# EAGLE design adapter_HVSP (EAGLE 5.04)
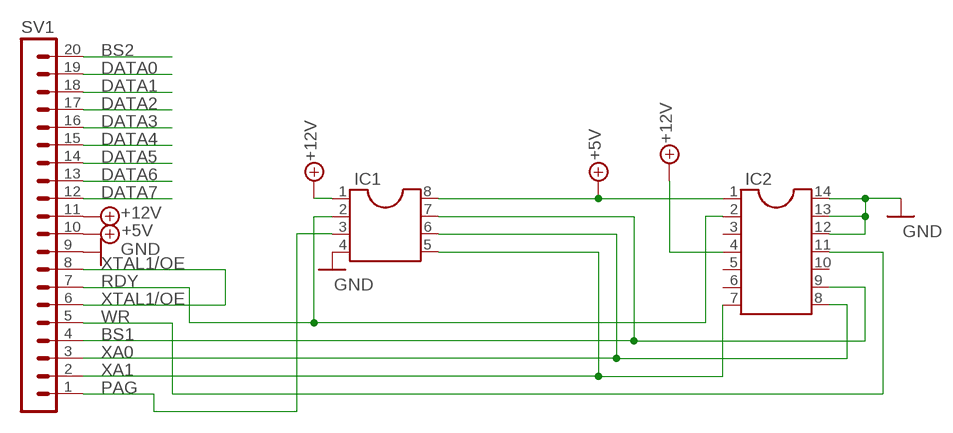
[diagram p0: schematic, sheet 1]

## Parts
IC1  DIL8S  [SOCKED-08]
IC2  DIL14S  [SOCKED-14]
SV1  MA20-1  [MA20-1]

## Nets
+5V: IC1.8 IC2.1 SV1.10
+12V: IC1.1 IC2.4 SV1.11
BS1: IC1.7 IC2.9 SV1.4
BS2: SV1.20
DATA0: SV1.19
DATA1: SV1.18
DATA2: SV1.17
DATA3: SV1.16
DATA4: SV1.15
DATA5: SV1.14
DATA6: SV1.13
DATA7: SV1.12
GND: IC1.4 IC2.12 IC2.13 IC2.14 SV1.9
PAG: IC1.3 SV1.1
RDY: IC1.2 IC2.2 SV1.7
WR: IC2.11 SV1.5
XA0: IC1.6 IC2.8 SV1.3
XA1: IC1.5 IC2.7 SV1.2
XTAL1/OE: SV1.6 SV1.8
Unconnected: IC2.3 IC2.5 IC2.6 IC2.10

## Library data of the parts
IC1 = ic-package:DIL8: Dual In Line
IC2 = ic-package:DIL14: Dual In Line
SV1 = con-lstb:MA20-1: PIN HEADER

## Board
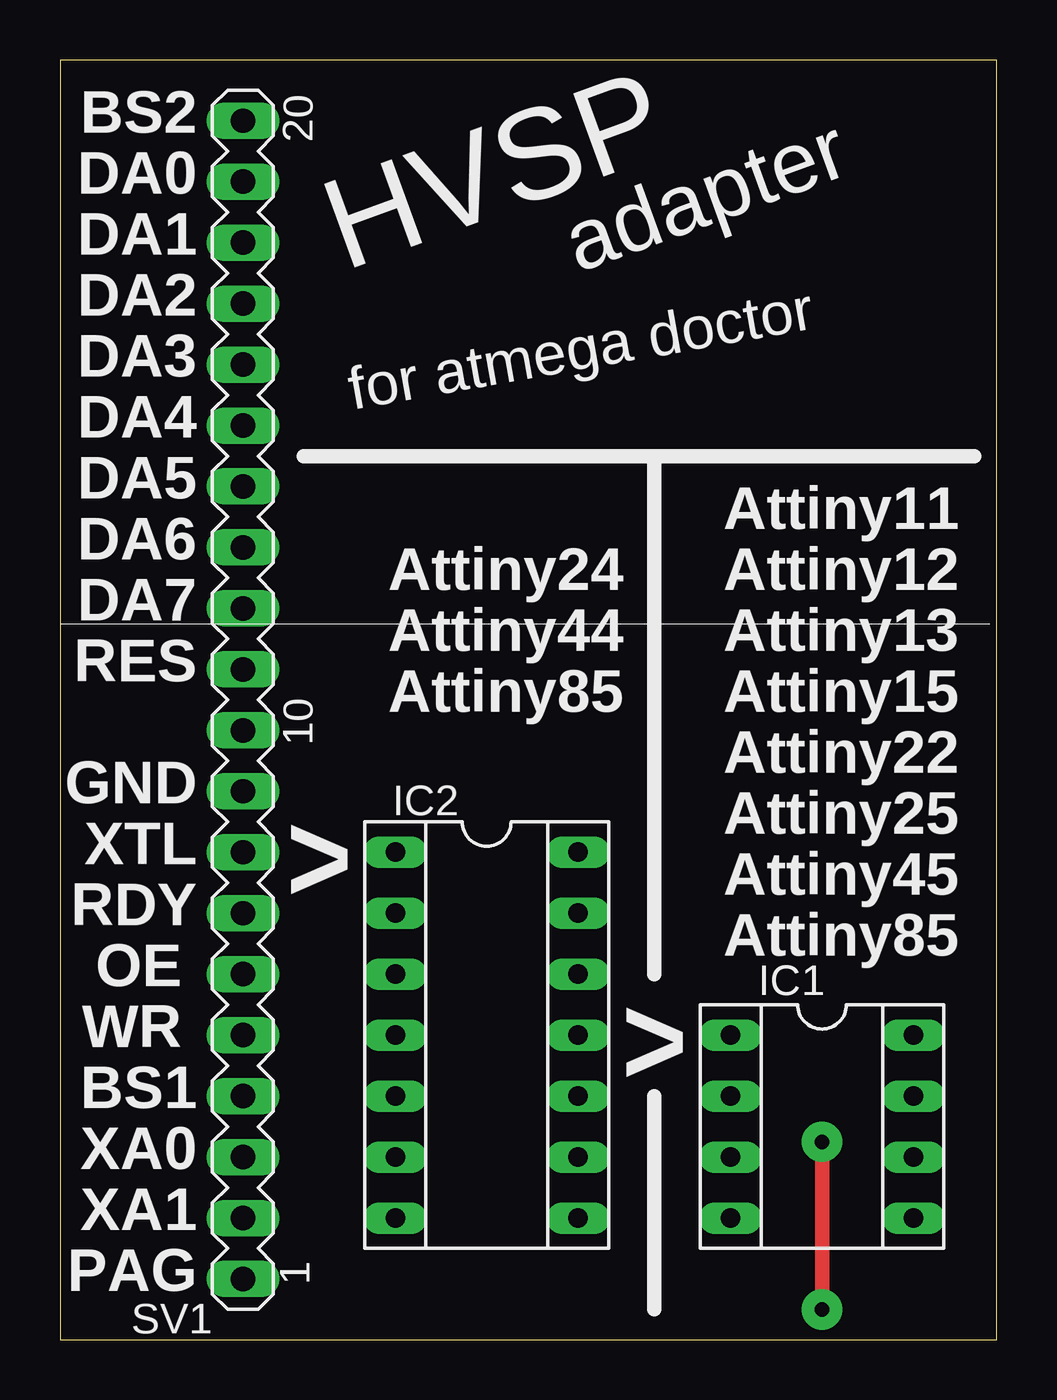
[diagram p1: board, top side]
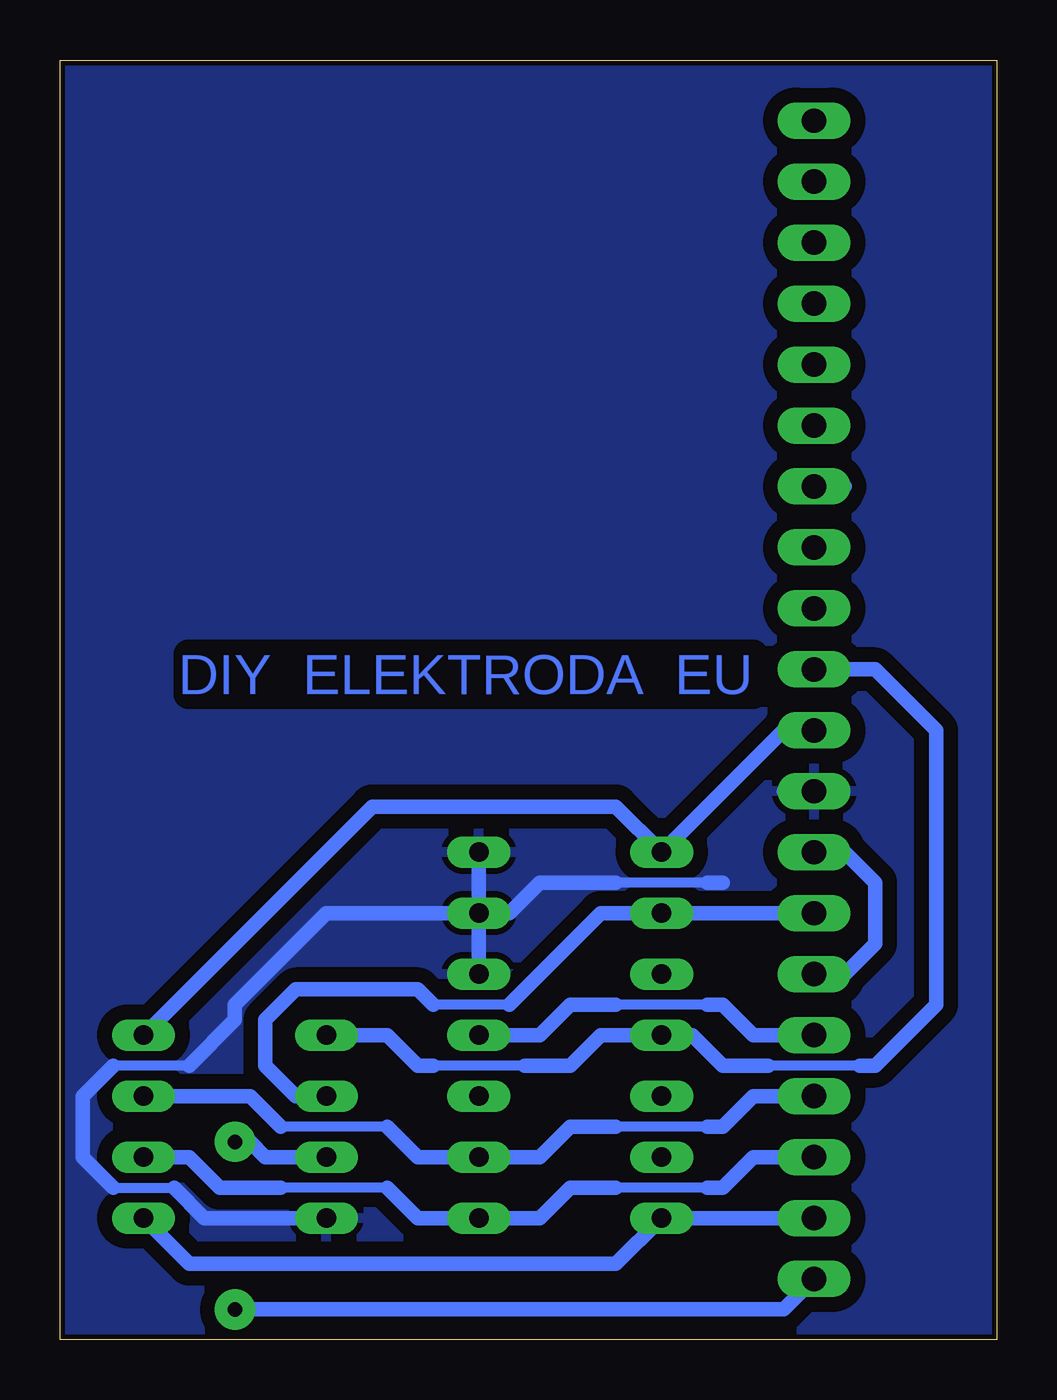
[diagram p2: board, bottom side, seen from below]

Size 39.04 x 53.33 mm. Coordinates in mm from the lower left corner, seen from the top.
Outline: 0,0 39.04,0 39.04,53.33 0,53.33 0,0
Copper layers (1*16): Top 0.035mm / dielectric 1.5mm / Bottom 0.035mm
Design rules "default *": minimum track width 10mil, minimum drill 24mil, track to track 24mil, track to pad 24mil, pad to pad 8mil, via to via 8mil, smd to smd 8mil, copper to edge 8mil, drill to drill 8mil, minimum pad ring 10mil, minimum via ring 8mil, stop-mask expansion 4mil, vias tented up to drill 0mil, thermal gap 10mil

### Footprints (pad centres in the part's own frame; a part is rotated, then mirrored left to right if it is on the bottom)
SOCKED-08 = drill 0.813 long: 1 -3.81,-3.81; 2 -1.27,-3.81; 3 1.27,-3.81; 4 3.81,-3.81; 5 3.81,3.81; 6 1.27,3.81; 7 -1.27,3.81; 8 -3.81,3.81
SOCKED-14 = drill 0.813 long: 1 -7.62,-3.81; 2 -5.08,-3.81; 3 -2.54,-3.81; 4 0,-3.81; 5 2.54,-3.81; 6 5.08,-3.81; 7 7.62,-3.81; 8 7.62,3.81; 9 5.08,3.81; 10 2.54,3.81; 11 0,3.81; 12 -2.54,3.81; 13 -5.08,3.81; 14 -7.62,3.81
MA20-1 = drill 1.016 long: 1 -24.13,0; 2 -21.59,0; 3 -19.05,0; 4 -16.51,0; 5 -13.97,0; 6 -11.43,0; 7 -8.89,0; 8 -6.35,0; 9 -3.81,0; 10 -1.27,0; 11 1.27,0; 12 3.81,0; 13 6.35,0; 14 8.89,0; 15 11.43,0; 16 13.97,0; 17 16.51,0; 18 19.05,0; 19 21.59,0; 20 24.13,0

### Placement (x,y rotation side)
IC1  31.75,8.89 270 top
IC2  17.78,12.7 270 top
SV1  7.62,26.67 90 top

### Tracks (layer width: path | path; a pad name or v marks a point on that pad's centre or on a via)
+5V
  Bottom 0.61: SV1.10 8.89,25.4 IC2.1 15.88,22.23 26.04,22.23 IC1.8
+12V
  Bottom 0.406: 19.68,11.43 23.5,11.43 | 5.71,11.43 9.53,11.43
  Bottom 0.61: 19.68,11.43 17.78,11.43 16.51,12.7 IC2.4 12.7,12.7 11.43,11.43 9.53,11.43 | 23.5,11.43 24.13,11.43 25.4,12.7 IC1.1 | SV1.11 5.08,27.94 2.54,25.4 2.54,13.97 5.08,11.43 5.71,11.43
BS1
  Bottom 0.406: 12.06,8.89 15.88,8.89 | 25.4,8.89 29.84,8.89
  Bottom 0.61: SV1.4 10.16,10.16 11.43,8.89 12.06,8.89 | 15.88,8.89 17.78,8.89 19.05,7.62 IC2.9 24.13,7.62 25.4,8.89 | 29.84,8.89 31.11,10.16 IC1.7
DATA5
  Bottom 0.61: 6.35,35.56 SV1.14
GND
  Bottom 0.406: 36.83,6.35 34.29,6.35 | 33.66,11.43 36.83,11.43 | 12.06,19.05 15.88,19.05
  Bottom 0.61: IC2.13 IC2.14 | IC2.13 IC2.12 | IC1.4 33.02,5.08 34.29,6.35 | 36.83,6.35 38.1,7.62 38.1,10.16 36.83,11.43 | 33.66,11.43 31.75,13.34 31.75,13.97 27.94,17.78 IC2.13 | SV1.9 8.89,22.86 | 12.06,19.05 11.43,19.05 | 15.88,19.05 19.05,19.05 20.32,17.78 IC2.13
  pour Bottom: 0,53.34 38.73,53.34 38.73,0 0,0
PAG  (via drill 0.6 pad 1.68)
  Top 0.61: v31.75,1.27 v31.75,8.26
  Bottom 0.61: SV1.1 8.89,1.27 v31.75,1.27 | IC1.3 30.48,7.62 31.11,8.26 v31.75,8.26
RDY
  Bottom 0.406: 20.32,13.97 23.5,13.97
  Bottom 0.61: IC1.2 29.21,10.16 30.48,11.43 30.48,13.34 29.21,14.61 24.13,14.61 23.5,13.97 | 20.32,13.97 16.51,17.78 IC2.2 SV1.7
WR
  Bottom 0.406: 12.06,13.97 15.88,13.97
  Bottom 0.61: IC2.11 19.05,12.7 17.78,13.97 15.88,13.97 | 12.06,13.97 11.43,13.97 10.16,12.7 SV1.5
XA0
  Bottom 0.406: 12.06,6.35 15.88,6.35 | 25.4,6.35 29.84,6.35
  Bottom 0.61: SV1.3 10.16,7.62 11.43,6.35 12.06,6.35 | 15.88,6.35 17.78,6.35 19.05,5.08 IC2.8 24.13,5.08 25.4,6.35 | 29.84,6.35 32.38,6.35 33.66,7.62 IC1.6
XA1
  Bottom 0.61: SV1.2 IC2.7 15.88,3.17 33.66,3.17 IC1.5
XTAL1/OE
  Bottom 0.61: SV1.8 6.35,20.32 5.08,19.05 5.08,16.51 6.35,15.24 SV1.6

### Text on the board
Bottom: DIY ELEKTRODA EU
tPlace: BS2 | DA0 | DA1 | HVSP | DA2 | adapter | DA3 | DA4 | for atmega doctor | DA5 | Attiny11 | DA6 | Attiny24 | Attiny12 | DA7 | Attiny44 | Attiny13 | RES | Attiny85 | Attiny15 | Attiny22 | GND | Attiny25 | XTL | ^ | Attiny45 | RDY | Attiny85 | OE | WR | ^ | BS1 | XA0 | XA1 | PAG